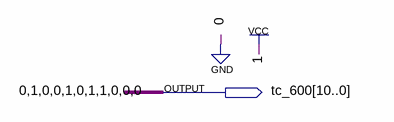
[diagram p0: schematic sheet]
// Quartus schematic tc_600.bdf as structural Verilog: 0 symbols, 1 pins
module tc_600 (
  output [10:0] tc_600
);


  assign tc_600 = 11'b01001011000;
endmodule
